# EAGLE design WarpCoreControl (EAGLE 8.5.0)
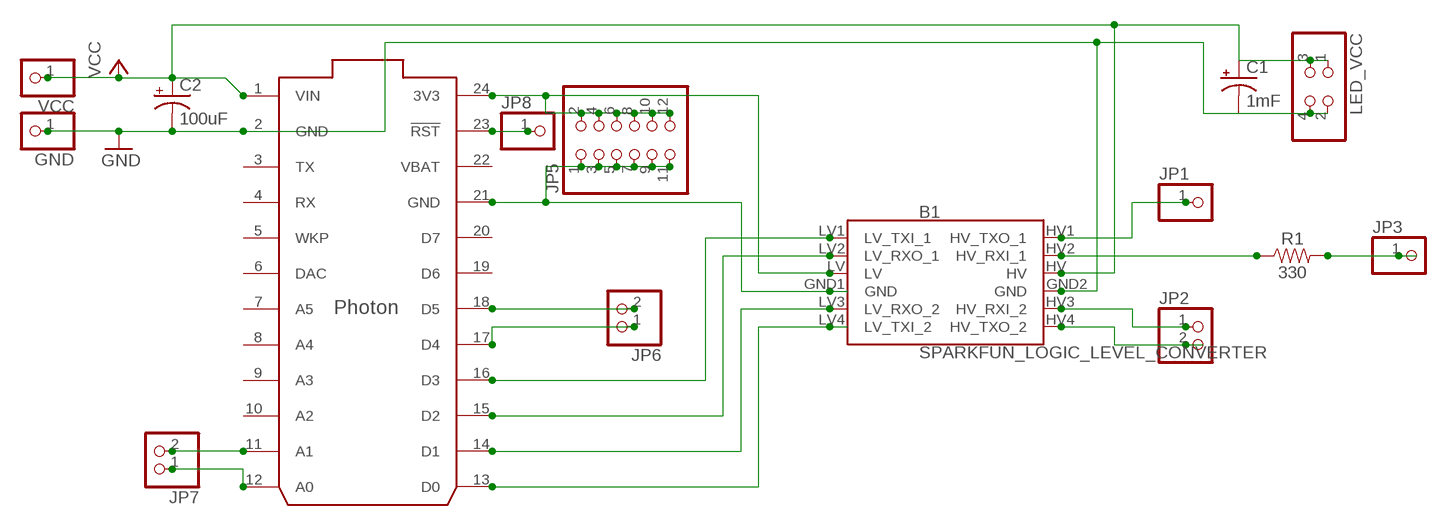
[diagram p0: schematic, sheet 1]

## Parts
B1  SPARKFUN_LOGIC_LEVEL_CONVERTER  [SPARKFUN_LOGIC_LEVEL_CONVERTER]
C1  1mF  1000UF-RADIAL-5MM-25V-20%  [CPOL-RADIAL-5MM-10MM]
C2  100uF  100UF-POLAR-RADIAL-2.5MM-25V-20%  [CPOL-RADIAL-2.5MM-6.5MM]
GND  PINHD-1X1  [1X01]
JP1  PINHD-1X1  [1X01]
JP2  PINHD-1X2  [1X02]
JP3  PINHD-1X1  [1X01]
JP5  PINHD-2X6  [2X06]
JP6  PINHD-1X2  [1X02]
JP7  PINHD-1X2  [1X02]
JP8  PINHD-1X1  [1X01]
LED_VCC  PINHD-2X2  [2X02]
R1  330  RESISTORAXIAL-0.3  [AXIAL-0.3]
U$1  PHOTON_WITH_HEADERS  [PHOTON]
VCC  PINHD-1X1  [1X01]

## Nets
3V3: B1.LV JP5.2 JP5.4 JP5.6 JP5.8 JP5.10 JP5.12 U$1.24(3V3)
A0: JP7.1 U$1.12(A0)
A1: JP7.2 U$1.11(A1)
D0: B1.LV4(LV_TXI_2) U$1.13(D0)
D1: B1.LV3(LV_RXO_2) U$1.14(D1)
D2: B1.LV2(LV_RXO_1) U$1.15(D2)
D3: B1.LV1(LV_TXI_1) U$1.16(D3)
D4: JP6.1 U$1.17(D4)
D5: JP6.2 U$1.18(D5)
GND: B1.GND1(GND) B1.GND2(GND) C1.- C2.2(-) GND.1 JP5.1 JP5.3 JP5.5 JP5.7 JP5.9 JP5.11 LED_VCC.2 LED_VCC.4 U$1.2(GND) U$1.21(GND)
HAD2: JP3.1 R1.P$2
HD0: B1.HV4(HV_TXO_2) JP2.2
HD1: B1.HV3(HV_RXI_2) JP2.1
HD2: B1.HV2(HV_RXI_1) R1.P$1
HD3: B1.HV1(HV_TXO_1) JP1.1
RST: JP8.1 U$1.23(!RST)
VCC: B1.HV C1.+ C2.1(+) LED_VCC.1 LED_VCC.3 U$1.1(VIN) VCC.1
Unconnected: U$1.3(TX) U$1.4(RX) U$1.5(WKP) U$1.6(DAC) U$1.7(A5) U$1.8(A4) U$1.9(A3) U$1.10(A2) U$1.19(D6) U$1.20(D7)

## Power pins joined to a net without a drawn wire
VBAT: U$1.22(VBAT)

## Library data of the parts
B1 = SparkFun-Boards:SPARKFUN_LOGIC_LEVEL_CONVERTER: SparkFun Logic Level Converter -Bi-Directional This is the mechnical outline for the 3.3V - 5V bi directional logic level converter. *Note, the "LOCK" Package has the header pins staggered by an offset of 5 mils (off center line), so that when you slide a row of standard 0.1" headers into the PTH pads, it will hold position vertically. See the follwing turorial for more information on this type of special footprints: Sneaky Footprints <https://www.sparkfun.com/tutorials/114> SparkFun Products: SparkFun Logic Level Converter - Bi-Directional <https://www.sparkfun.com/products/12009>
C1 = SparkFun-Capacitors:1000UF: 1,000µF/1mF ceramic capacitors A capacitor is a passive two-terminal electrical component used to store electrical energy temporarily in an electric field. CAP-08070; PROD_ID: CAP-09538
C2 = SparkFun-Capacitors:100UF-POLAR: 100µF polarized capacitors A capacitor is a passive two-terminal electrical component used to store electrical energy temporarily in an electric field.; PROD_ID: CAP-08439
GND JP1 JP3 JP8 VCC = pinhead:PINHD-1X1: PIN HEADER
JP2 JP6 JP7 = pinhead:PINHD-1X2: PIN HEADER
JP5 = pinhead:PINHD-2X6: PIN HEADER
LED_VCC = pinhead:PINHD-2X2: PIN HEADER
R1 = SparkFun-Resistors:RESISTOR: Generic Resistor Package
U$1 = Spark:PHOTON

## Board
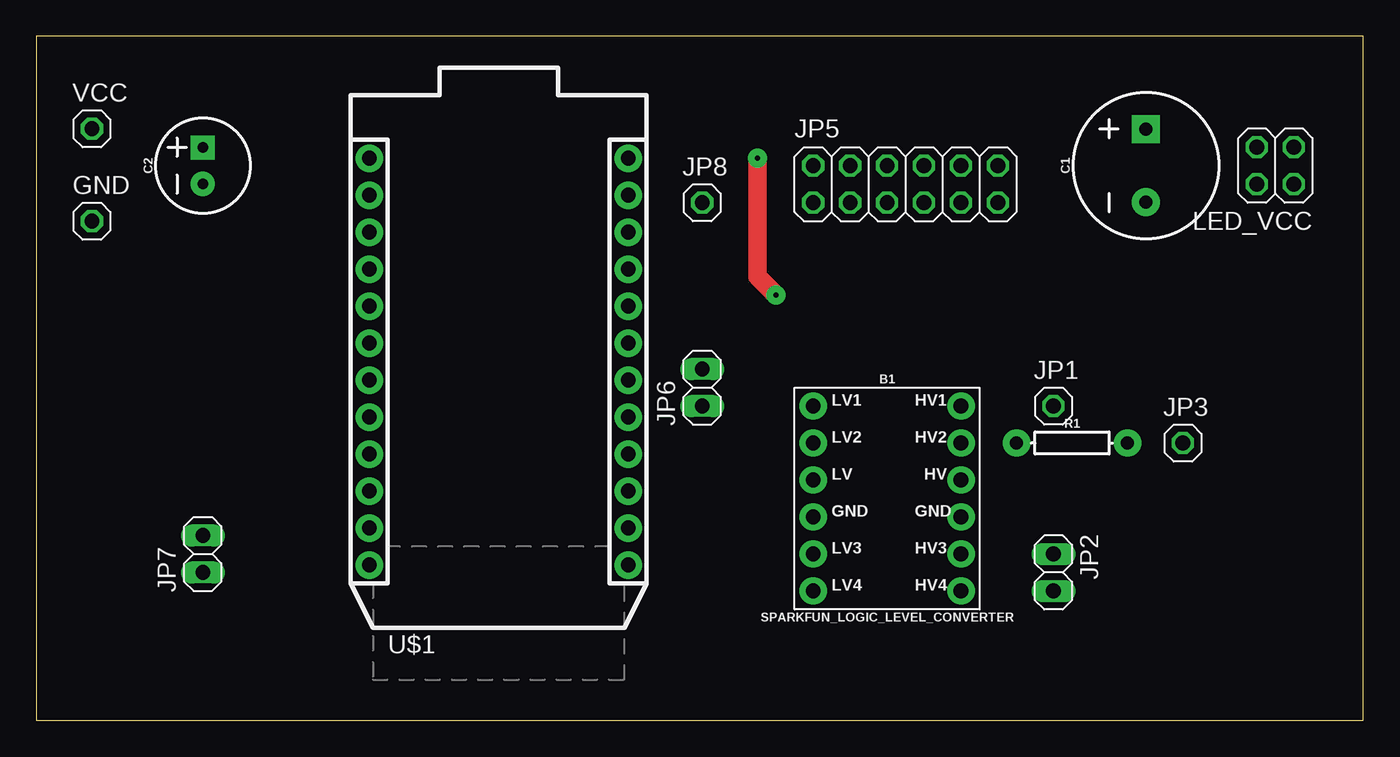
[diagram p1: board, top side]
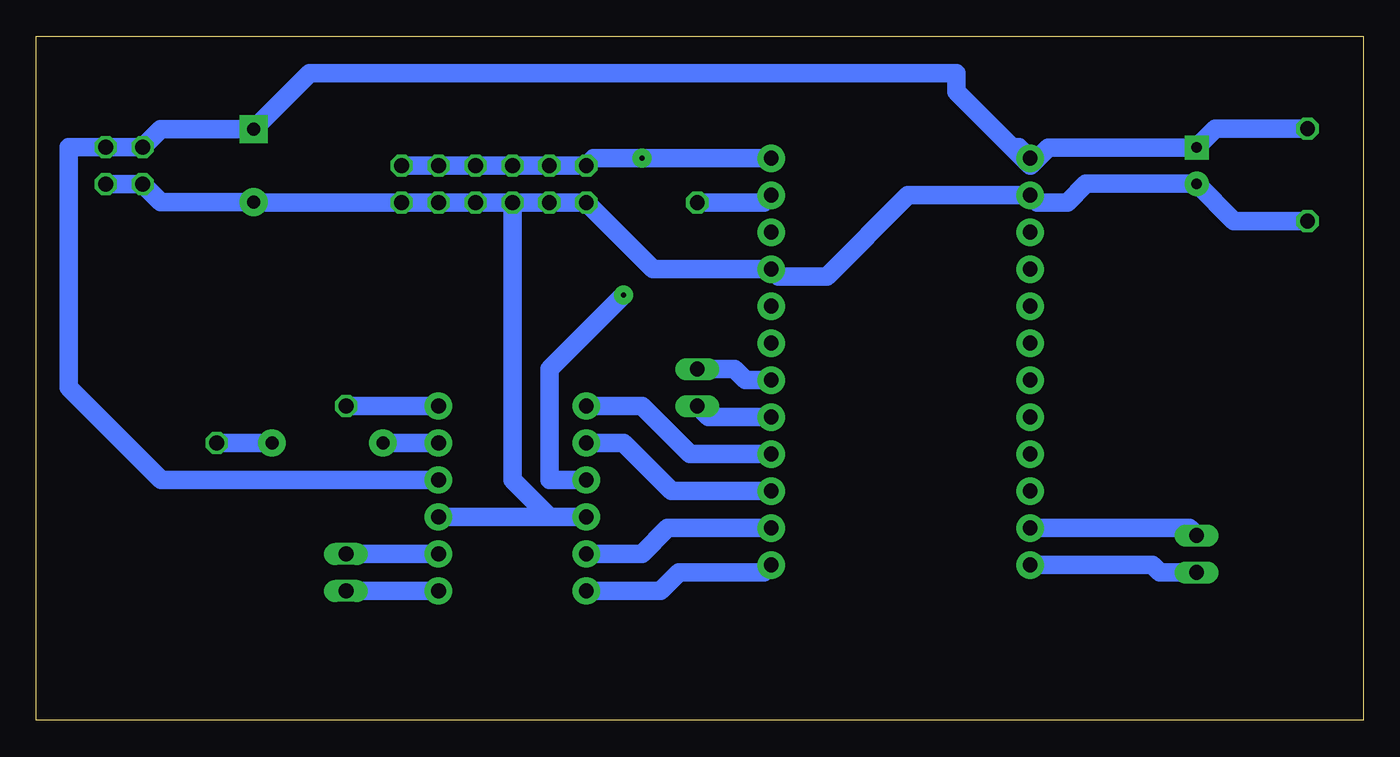
[diagram p2: board, bottom side, seen from below]

Size 91.11 x 46.98 mm. Coordinates in mm from the lower left corner, seen from the top.
Outline: 0,0 91.11,0 91.11,46.98 0,46.98 0,0
Copper layers (1*16): Top 0.035mm / dielectric 1.5mm / Bottom 0.035mm
Design rules "default": minimum track width 6mil, minimum drill 0.35mm, track to track 6mil, track to pad 6mil, pad to pad 6mil, via to via 6mil, smd to smd 6mil, copper to edge 40mil, drill to drill 6mil, minimum pad ring 10mil, minimum via ring 8mil, stop-mask expansion 4mil, vias tented up to drill 0mil, thermal gap 10mil

### Footprints (pad centres in the part's own frame; a part is rotated, then mirrored left to right if it is on the bottom)
SPARKFUN_LOGIC_LEVEL_CONVERTER = drill 1.016 pad 1.88: GND1 -5.08,-1.27; GND2 5.08,-1.27; HV 5.08,1.27; HV1 5.08,6.35; HV2 5.08,3.81; HV3 5.08,-3.81; HV4 5.08,-6.35; LV -5.08,1.27; LV1 -5.08,6.35; LV2 -5.08,3.81; LV3 -5.08,-3.81; LV4 -5.08,-6.35
CPOL-RADIAL-5MM-10MM = drill 0.9 pad 1.93 square: + 2.5,0 | drill 0.9 pad 1.93: - -2.5,0
CPOL-RADIAL-2.5MM-6.5MM = drill 0.7 pad 1.651 square: 1 1.25,0 | drill 0.7 pad 1.651: 2 -1.25,0
1X01 = drill 1.016 octagon: 1 0,0
1X02 = drill 1.016 long: 1 -1.27,0; 2 1.27,0
2X06 = drill 1.016 octagon: 1 -6.35,-1.27; 2 -6.35,1.27; 3 -3.81,-1.27; 4 -3.81,1.27; 5 -1.27,-1.27; 6 -1.27,1.27; 7 1.27,-1.27; 8 1.27,1.27; 9 3.81,-1.27; 10 3.81,1.27; 11 6.35,-1.27; 12 6.35,1.27
2X02 = drill 1.016 octagon: 1 -1.27,-1.27; 2 -1.27,1.27; 3 1.27,-1.27; 4 1.27,1.27
AXIAL-0.3 = drill 0.9 pad 1.88: P$1 -3.81,0; P$2 3.81,0
PHOTON = drill 1.016 pad 1.88: 1 1.27,32.258; 2 1.27,29.718; 3 1.27,27.178; 4 1.27,24.638; 5 1.27,22.098; 6 1.27,19.558; 7 1.27,17.018; 8 1.27,14.478; 9 1.27,11.938; 10 1.27,9.398; 11 1.27,6.858; 12 1.27,4.318; 13 19.05,4.318; 14 19.05,6.858; 15 19.05,9.398; 16 19.05,11.938; 17 19.05,14.478; 18 19.05,17.018; 19 19.05,19.558; 20 19.05,22.098; 21 19.05,24.638; 22 19.05,27.178; 23 19.05,29.718; 24 19.05,32.258

### Placement (x,y rotation side)
B1  58.42,15.24 0 top
C1  76.2,38.1 90 top
C2  11.43,38.1 90 top
GND  3.81,34.29 0 top
JP1  69.85,21.59 0 top
JP2  69.85,10.16 270 top
JP3  78.74,19.05 0 top
JP5  59.69,36.83 0 top
JP6  45.72,22.86 90 top
JP7  11.43,11.43 90 top
JP8  45.72,35.56 0 top
LED_VCC  85.09,38.1 180 top
R1  71.12,19.05 0 top
U$1  21.59,6.35 0 top
VCC  3.81,40.64 0 top

### Tracks (layer width: path | path; a pad name or v marks a point on that pad's centre or on a via)
3V3  (via drill 0.35 pad 1.3)
  Top 1.27: v50.8,29.21 49.53,30.48 v49.53,38.61
  Bottom 1.27: U$1.24 v49.53,38.61 52.83,38.61 JP5.2 JP5.4 JP5.6 JP5.8 JP5.10 JP5.12 | B1.LV 55.88,16.51 55.88,24.13 v50.8,29.21
A0
  Bottom 1.27: U$1.12 14.48,10.67 13.97,10.16 JP7.1
A1
  Bottom 1.27: U$1.11 11.94,13.21 JP7.2
D0
  Bottom 1.27: U$1.13 41.15,10.16 46.99,10.16 48.26,8.89 B1.LV4
D1
  Bottom 1.27: U$1.14 47.75,13.21 49.53,11.43 B1.LV3
D2
  Bottom 1.27: U$1.15 47.5,15.75 50.8,19.05 B1.LV2
D3
  Bottom 1.27: U$1.16 46.23,18.29 49.53,21.59 B1.LV1
D4
  Bottom 1.27: U$1.17 44.96,20.83 JP6.1
D5
  Bottom 1.27: U$1.18 42.42,23.37 43.18,24.13 JP6.2
GND
  Bottom 1.27: GND.1 8.87,34.29 C2.2 19.03,36.85 20.32,35.56 22.35,35.56 U$1.2 31.24,36.07 36.83,30.48 40.13,30.48 U$1.21 48.77,30.99 JP5.1 JP5.3 JP5.5 | JP5.5 JP5.7 JP5.9 JP5.11 76.16,35.56 C1.- 82.59,35.6 LED_VCC.4 LED_VCC.2 | B1.GND2 B1.GND1 55.88,13.97 58.42,16.51 JP5.5
HAD2
  Bottom 1.27: R1.P$2 JP3.1
HD0
  Bottom 1.27: B1.HV4 JP2.2
HD1
  Bottom 1.27: B1.HV3 JP2.1
HD2
  Bottom 1.27: B1.HV2 R1.P$1
HD3
  Bottom 1.27: B1.HV1 JP1.1
RST
  Bottom 1.27: U$1.23 41.15,35.56 JP8.1
VCC
  Bottom 1.27: VCC.1 10.16,40.64 11.43,39.37 C2.1 21.61,39.35 22.86,38.1 24.13,39.37 | 24.13,39.37 27.94,43.18 27.94,44.45 72.35,44.45 C1.+ 82.59,40.6 LED_VCC.3 LED_VCC.1 88.9,39.37 88.9,22.86 82.55,16.51 B1.HV | U$1.1 23.62,39.37 24.13,39.37